# EAGLE design MCU_Module V3 (EAGLE 7.6.0)
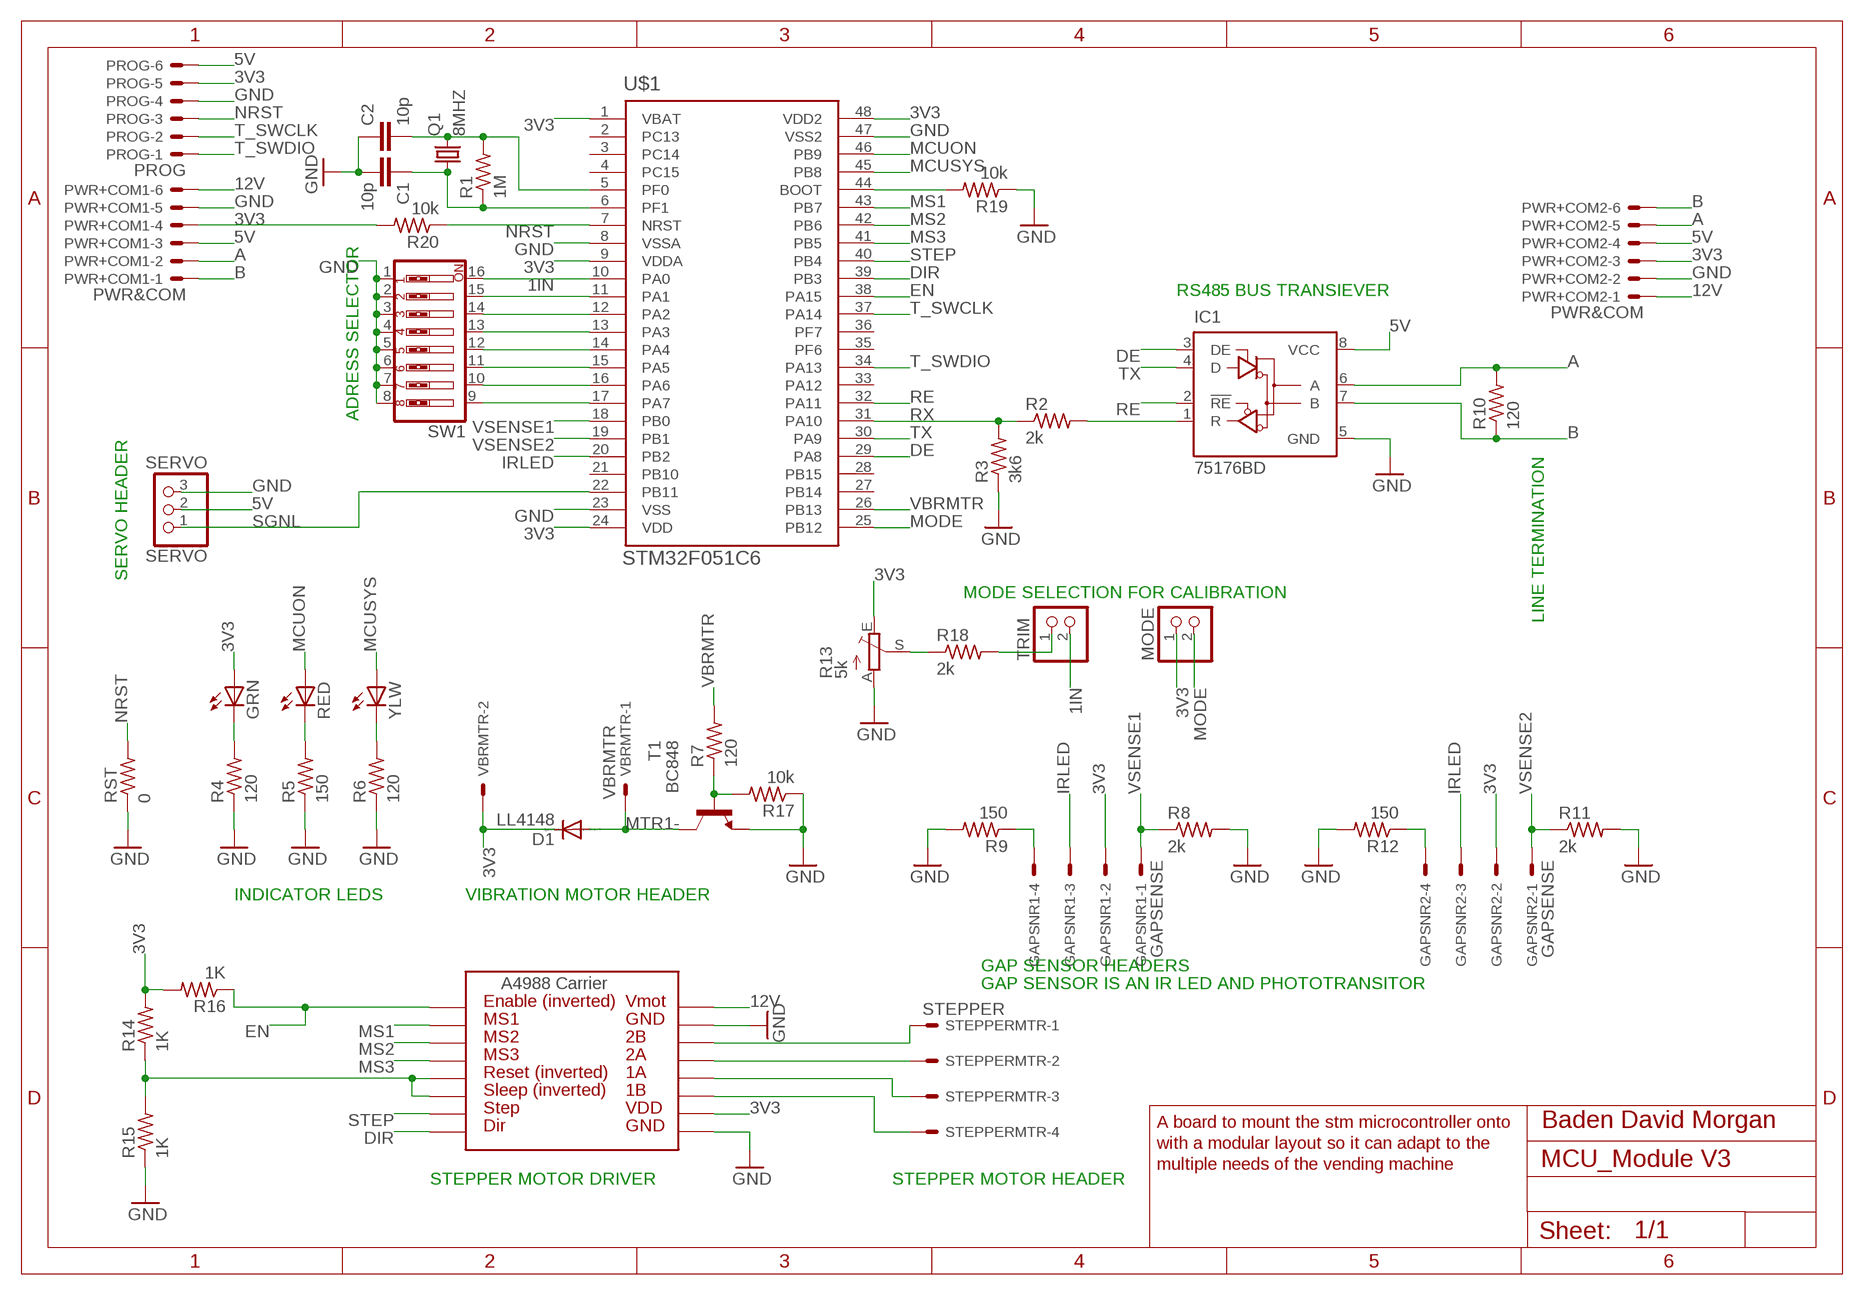
[diagram p0: schematic, sheet 1]

## Parts
C1  10p  C-EUC0805  [C0805]
C2  10p  C-EUC0805  [C0805]
D1  LL4148  PMLL4150  [SOD80C]
GAPSNR1  GAPSENSE  22-27-2041-04  [6410-04]
GAPSNR2  GAPSENSE  22-27-2041-04  [6410-04]
GRN  LEDSML1206  [SML1206]
IC1  75176BD  75176AD  [D_R-PDSO-G8]
MODE  PINHD-1X2  [1X02]
PROG  PROG  22-27-2061-06  [6410-06]
PWR+COM1  PWR&COM  22-05-7068-06  [7395-06]
PWR+COM2  PWR&COM  22-05-7068-06  [7395-06]
Q1  8MHZ  CRYSTALSM49  [SM49]
R1  1M  R-US_R0805  [R0805]
R2  2k  R-US_R0805  [R0805]
R3  3k6  R-US_R0805  [R0805]
R4  120  R-US_R0805  [R0805]
R5  150  R-US_R0805  [R0805]
R6  120  R-US_R0805  [R0805]
R7  120  R-US_R0805  [R0805]
R8  2k  R-US_R0805  [R0805]
R9  150  R-US_R0805  [R0805]
R10  120  R-US_R0805  [R0805]
R11  2k  R-US_R0805  [R0805]
R12  150  R-US_R0805  [R0805]
R13  5k  TRIM_EU-B25P  [B25P]
R14  1K  R-US_R0805  [R0805]
R15  1K  R-US_R0805  [R0805]
R16  1K  R-US_R0805  [R0805]
R17  10k  R-US_R0805  [R0805]
R18  2k  R-US_R0805  [R0805]
R19  10k  R-US_R0805  [R0805]
R20  10k  R-US_R0805  [R0805]
RED  LEDSML1206  [SML1206]
RST  0  R-US_R0805  [R0805]
SERVO  SERVO  PINHD-1X3  [1X03]
STEPPERMTR  STEPPER  22-27-2041-04  [6410-04]
SW1  SW_DIP-8  [EDG-08]
T1  BC848  [SOT23]
TRIM  PINHD-1X2  [1X02]
U$1  STM32F051C6  [QFP50P900X900X160-48N]
U$2  A4983CARRIER  [A4988BREAKOUT]
VBRMTR  VBRMTR  22-27-2021-02  [6410-02]
YLW  LEDSML1206  [SML1206]

## Nets
1IN: SW1.16 TRIM.2 U$1.10(PA0)
3V3: D1.C GAPSNR1.2 GAPSNR2.2 GRN.A MODE.1 PROG.5 PWR+COM1.4 PWR+COM2.3 R13.E R14.2 R16.2 R20.2 U$1.1(VBAT) U$1.9(VDDA) U$1.24(VDD) U$1.48(VDD2) U$2.VDD VBRMTR.2
5V: IC1.8(VCC) PROG.6 PWR+COM1.3 PWR+COM2.4 SERVO.2
8IN: SW1.9 U$1.17(PA7)
12V: PWR+COM1.6 PWR+COM2.1 U$2.VMOT
A: IC1.6(A) PWR+COM1.2 PWR+COM2.5 R10.2
B: IC1.7(B) PWR+COM1.1 PWR+COM2.6 R10.1
DE: IC1.3(DE) U$1.29(PA8)
DIR: U$1.39(PB3) U$2.DIR
EN: R16.1 U$1.38(PA15) U$2.EN
GND: C1.2 C2.1 IC1.5(GND) PROG.4 PWR+COM1.5 PWR+COM2.2 R3.1 R4.1 R5.1 R6.1 R8.2 R9.2 R11.2 R12.2 R13.A R15.1 R17.1 R19.1 RST.1 SERVO.3 SW1.1 SW1.2 SW1.3 SW1.4 SW1.5 SW1.6 SW1.7 SW1.8 T1.2(E) U$1.8(VSSA) U$1.23(VSS) U$1.47(VSS2) U$2.GND U$2.GND@0(GND)
IRLED: GAPSNR1.3 GAPSNR2.3 U$1.20(PB2)
MCUON: RED.A U$1.46(PB9)
MCUSYS: U$1.45(PB8) YLW.A
MODE: MODE.2 U$1.25(PB12)
MS1: U$1.43(PB7) U$2.MS1
MS2: U$1.42(PB6) U$2.MS2
MS3: U$1.41(PB5) U$2.MS3
MTR1-: D1.A T1.3(C) VBRMTR.1
N$1: C1.1 Q1.1 R1.1 U$1.6(PF1)
N$2: C2.2 Q1.2 R1.2 U$1.5(PF0)
N$5: STEPPERMTR.4 U$2.1B
N$6: SW1.15 U$1.11(PA1)
N$7: SW1.14 U$1.12(PA2)
N$8: SW1.13 U$1.13(PA3)
N$9: IC1.1(R) R2.2
N$10: SW1.12 U$1.14(PA4)
N$11: SW1.11 U$1.15(PA5)
N$12: SW1.10 U$1.16(PA6)
N$13: R13.S R18.1
N$14: GRN.C R4.2
N$15: R5.2 RED.C
N$16: R6.2 YLW.C
N$17: R7.1 R17.2 T1.1(B)
N$18: STEPPERMTR.3 U$2.1A
N$19: GAPSNR1.4 R9.1
N$20: STEPPERMTR.2 U$2.2A
N$21: STEPPERMTR.1 U$2.2B
N$22: R19.2 U$1.44(BOOT)
N$23: R18.2 TRIM.1
N$24: GAPSNR2.4 R12.1
N$26: R14.1 R15.2 U$2.RST U$2.SLP(SLEEP)
NRST: PROG.3 R20.1 RST.2 U$1.7(NRST)
RE: IC1.2(!RE) U$1.32(PA11)
RX: R2.1 R3.2 U$1.31(PA10)
SGNL: SERVO.1 U$1.22(PB11)
STEP: U$1.40(PB4) U$2.STEP
T_SWCLK: PROG.2 U$1.37(PA14)
T_SWDIO: PROG.1 U$1.34(PA13)
TX: IC1.4(D) U$1.30(PA9)
VBRMTR: R7.2 U$1.26(PB13)
VSENSE1: GAPSNR1.1 R8.1 U$1.18(PB0)
VSENSE2: GAPSNR2.1 R11.1 U$1.19(PB1)
Unconnected: U$1.2(PC13) U$1.3(PC14) U$1.4(PC15) U$1.21(PB10) U$1.27(PB14) U$1.28(PB15) U$1.33(PA12) U$1.35(PF6) U$1.36(PF7)

## Notes on the sheet
- RS485 BUS TRANSIEVER
- ADRESS SELECTOR
- LINE TERMINATION
- SERVO HEADER
- MODE SELECTION FOR CALIBRATION
- INDICATOR LEDS | VIBRATION MOTOR HEADER
- GAP SENSOR HEADERS
- GAP SENSOR IS AN IR LED AND PHOTOTRANSITOR
- A board to mount the stm microcontroller onto | Baden David Morgan
- with a modular layout so it can adapt to the
- multiple needs of the vending machine
- STEPPER MOTOR DRIVER | STEPPER MOTOR HEADER

## Library data of the parts
C1 C2 = rcl:C-EU: CAPACITOR, European symbol
D1 = diode:PMLL4150: DIODE high speed
GAPSNR1 GAPSNR2 STEPPERMTR = con-molex:22-?-04: CONNECTOR wire to board 2.54 mm (.1 inch) pitch header; OC_FARNELL: unknown; OC_NEWARK: unknown
GRN RED YLW = led:LED: LED OSRAM: - CHIPLED LG R971, LG N971, LY N971, LG Q971, LY Q971, LO R971, LY R971 LH N974, LH R974 LS Q976, LO Q976, LY Q976 LO Q996 - Hyper CHIPLED LW Q18S LB Q993, LB Q99A, LB R99A - SideLED LS A670, LO A670, LY A670, LG A670, LP A670 LB A673, LV A673, LT A673, LW A673 LH A674 LY A675 LS A676, LA A676, LO A676, LY A676, LW A676 LS A679, LY A679, LG A679 - Hyper Micro SIDELED® LS Y876, LA Y876, LO Y876, LY Y876 LT Y87S - SmartLED LW L88C, LW L88S LB L89C, LB L89S, LG L890 LS L89K, LO L89K, LY L89K LS L896, LA L896, LO L896, LY L896 - TOPLED LS T670, LO T670, LY T670, LG T670, LP T670 LSG T670, LSP T670, LSY T670, LOP T670, LYG T670 LG T671, LOG T671, LSG T671 LB T673, LV T673, LT T673, LW T673 LH T674 LS T676, LA T676, LO T676, LY T676, LB T676, LH T676, LSB T676, LW T676 LB T67C, LV T67C, LT T67C, LS T67K, LO T67K, LY T67K, LW E67C LS E67B, LA E67B, LO E67B, LY E67B, LB E67C, LV E67C, LT E67C LW T67C LS T679, LY T679, LG T679 LS T770, LO T770, LY T770, LG T770, LP T770 LB T773, LV T773, LT T773, LW T773 LH T774 LS E675, LA E675, LY E675, LS T675 LS T776, LA T776, LO T776, LY T776, LB T776 LHGB T686 LT T68C, LB T68C - Hyper Mini TOPLED® LB M676 - Mini TOPLED Santana® LG M470 LS M47K, LO M47K, LY M47K Source: http://www.osram.convergy.de LUXEON: - LUMILED® LXK2-PW12-R00, LXK2-PW12-S00, LXK2-PW14-U00, LXK2-PW14-V00 LXK2-PM12-R00, LXK2-PM12-S00, LXK2-PM14-U00 LXK2-PE12-Q00, LXK2-PE12-R00, LXK2-PE12-S00, LXK2-PE14-T00, LXK2-PE14-U00 LXK2-PB12-K00, LXK2-PB12-L00, LXK2-PB12-M00, LXK2-PB14-N00, LXK2-PB14-P00, LXK2-PB14-Q00 LXK2-PR12-L00, LXK2-PR12-M00, LXK2-PR14-Q00, LXK2-PR14-R00 LXK2-PD12-Q00, LXK2-PD12-R00, LXK2-PD12-S00 LXK2-PH12-R00, LXK2-PH12-S00 LXK2-PL12-P00, LXK2-PL12-Q00, LXK2-PL12-R00 Source: www.luxeon.com KINGBRIGHT: KA-3528ASYC Source: www.kingbright.com
IC1 = 751xx:75176A: DIFFERENTIAL BUS TRANSCEIVER Source: http://focus.ti.com/lit/ds/symlink/sn75176a.pdf
MODE TRIM = pinhead:PINHD-1X2: PIN HEADER
PROG PWR+COM1 PWR+COM2 = con-molex:22-?-06: CONNECTOR wire to board 2.54 mm (.1 inch) pitch header; OC_FARNELL: unknown; OC_NEWARK: unknown
Q1 = crystal:CRYSTAL: CRYSTAL; OC_FARNELL: unknown; OC_NEWARK: unknown
R1 R4-R7 R9 R12 R14-R17 R19 R20 RST = rcl:R-US_: RESISTOR, American symbol
R2 R3 R8 R10 R11 R18 = resistor:R-US_: RESISTOR, American symbol
R13 = pot:TRIM_EU-: POTENTIOMETER
SERVO = pinhead:PINHD-1X3: PIN HEADER
SW1 = special:SW_DIP-8: DIP SWITCH
T1 = transistor:BC848: NPN TRANSISTOR
U$1 = STM32F0:STM32F051C6
U$2 = RepRapjr:A4983CARRIER
VBRMTR = con-molex:22-?-02: CONNECTOR wire to board 2.54 mm (.1 inch) pitch header; OC_FARNELL: unknown; OC_NEWARK: unknown

## Board
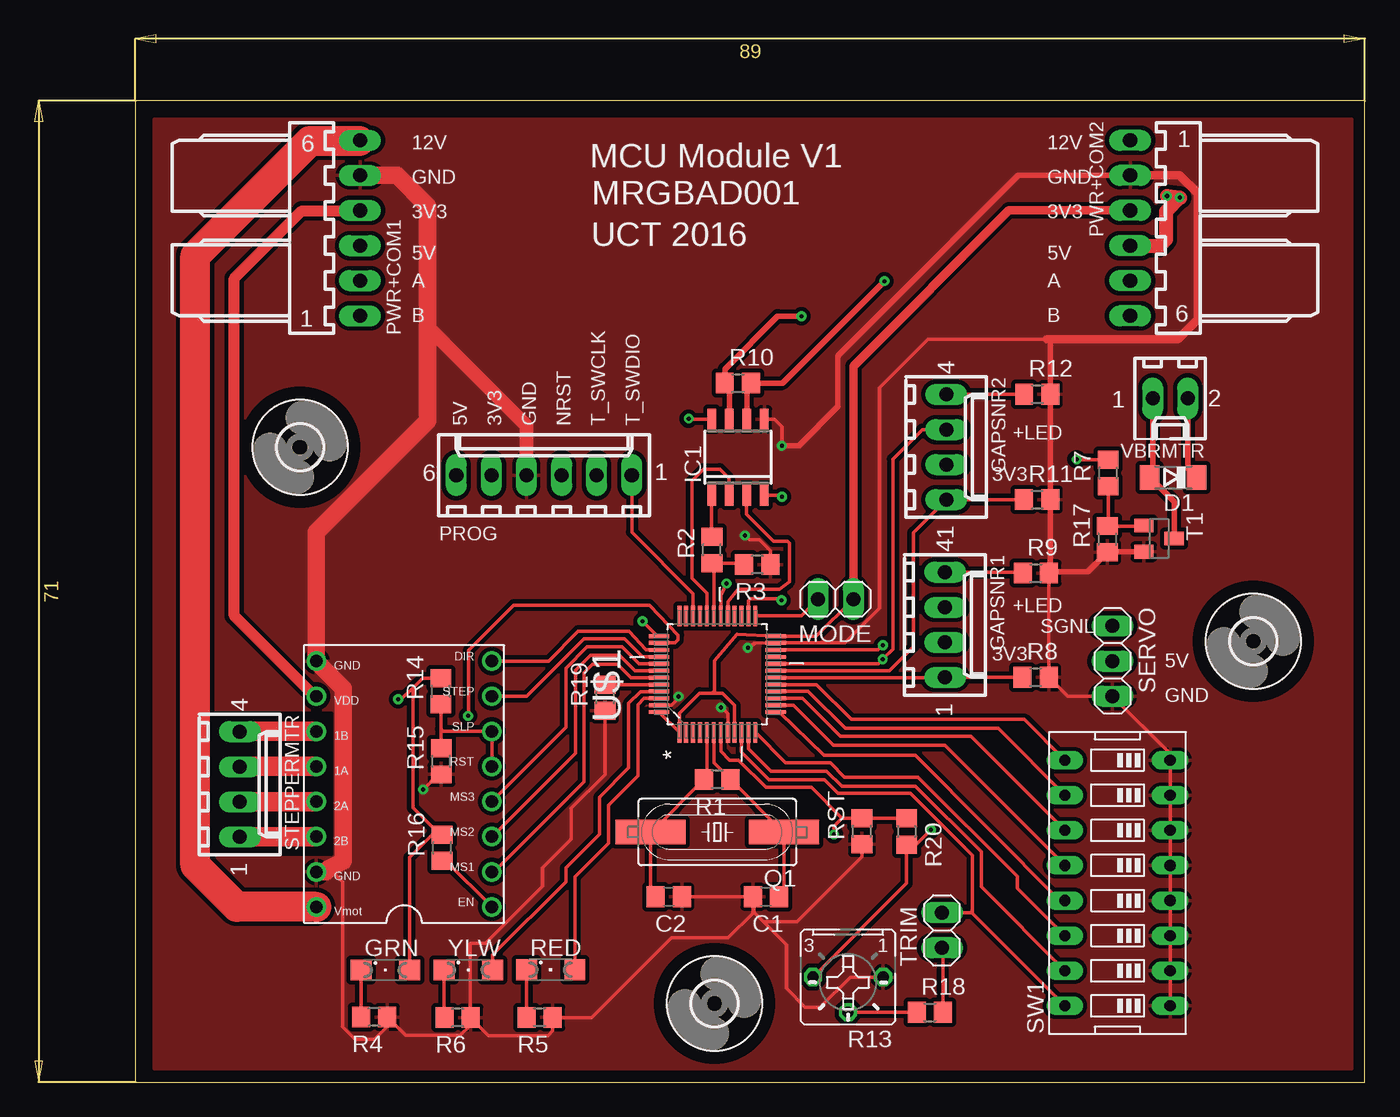
[diagram p1: board, top side]
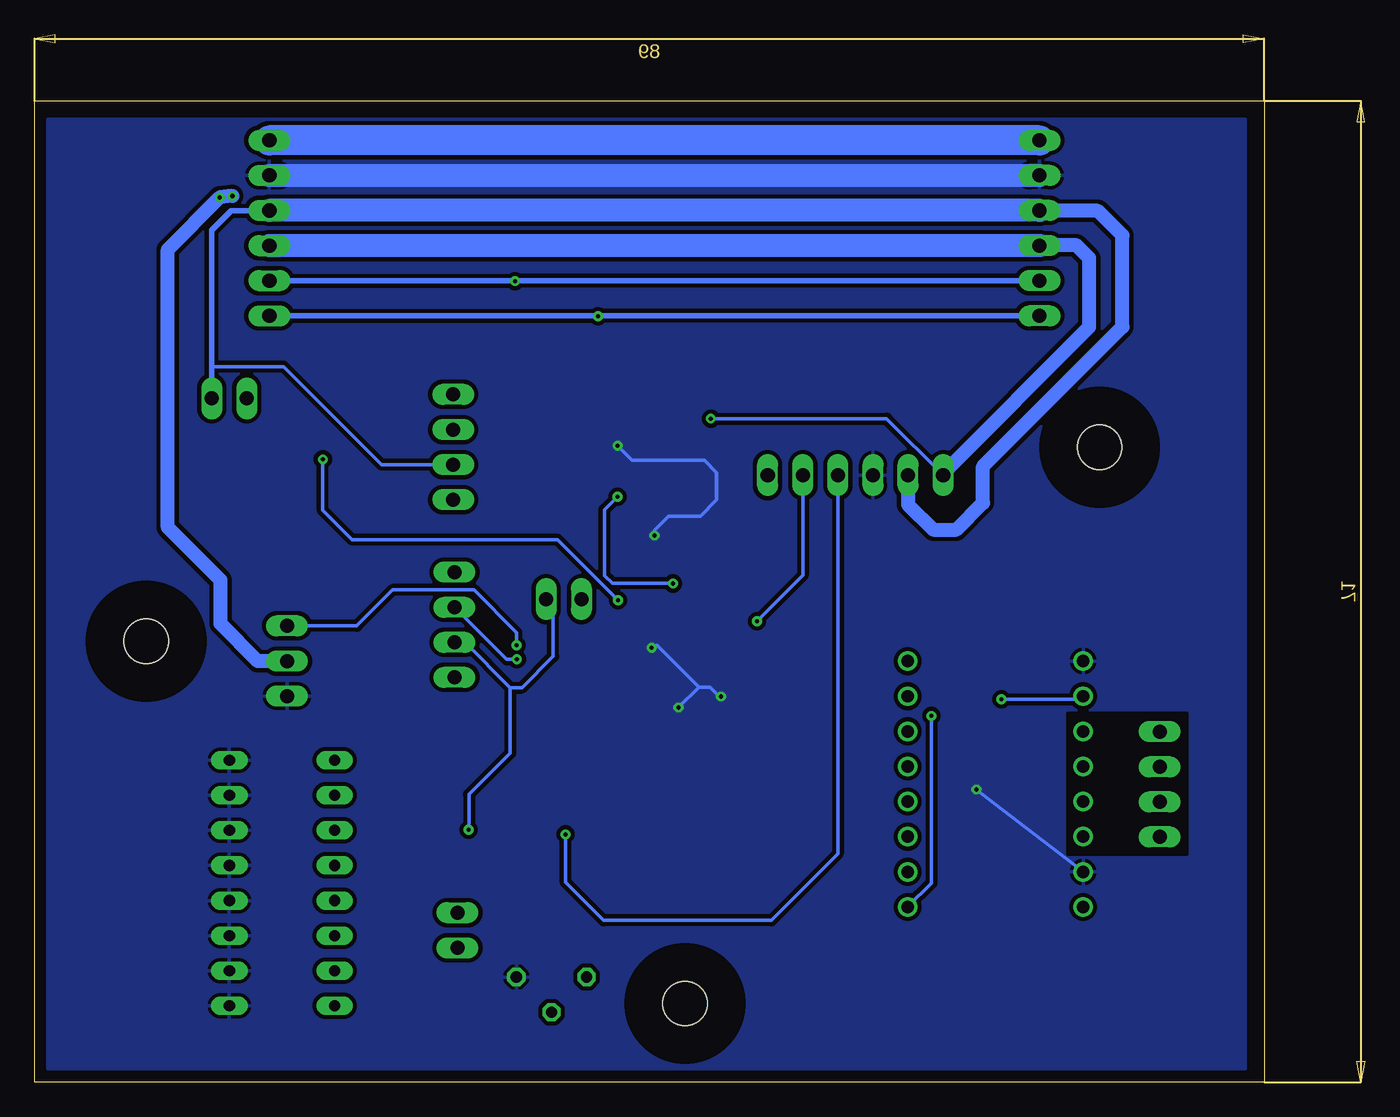
[diagram p2: board, bottom side, seen from below]

Size 89 x 71 mm. Coordinates in mm from the lower left corner, seen from the top.
Outline: 0,0 89,0 89,71 0,71 0,0
Copper layers (1*16): Top 0.035mm / dielectric 1.5mm / Bottom 0.035mm
Design rules "trax_discount_template": minimum track width 10mil, minimum drill 0.25mil, track to track 0.25mm, track to pad 0.25mm, pad to pad 0.25mm, via to via 0.25mm, smd to smd 0.25mm, copper to edge 0.25mm, drill to drill 0.3mm, minimum pad ring 10mil, minimum via ring 8mil, stop-mask expansion 4mil, vias tented up to drill 0mil, thermal gap 10mil

### Footprints (pad centres in the part's own frame; a part is rotated, then mirrored left to right if it is on the bottom)
C0805 = smd 1.3 x 1.5: 1 -0.95,0; 2 0.95,0
SOD80C = smd 1.4 x 1.8: A 1.7,0; C -1.7,0
6410-04 = drill 1.016 long: 1 3.81,0; 2 1.27,0; 3 -1.27,0; 4 -3.81,0
SML1206 = smd 1.5 x 1.5: A 1.75,0; C -1.75,0
D_R-PDSO-G8 = smd 0.6 x 1.5: 1 -1.905,-2.75; 2 -0.635,-2.75; 3 0.635,-2.75; 4 1.905,-2.75; 5 1.905,2.75; 6 0.635,2.75; 7 -0.635,2.75; 8 -1.905,2.75
1X02 = drill 1.016 long: 1 -1.27,0; 2 1.27,0
6410-06 = drill 1.016 long: 1 6.35,0; 2 3.81,0; 3 1.27,0; 4 -1.27,0; 5 -3.81,0; 6 -6.35,0
7395-06 = drill 1.016 long: 1 6.35,0; 2 3.81,0; 3 1.27,0; 4 -1.27,0; 5 -3.81,0; 6 -6.35,0
SM49 = smd 5.08 x 1.778: 1 -4.826,0; 2 4.826,0
R0805 = smd 1.3 x 1.5: 1 -0.95,0; 2 0.95,0
B25P = drill 0.813 octagon: A -2.54,0; E 2.54,0; S 0,2.54
1X03 = drill 1.016 long: 1 -2.54,0; 2 0,0; 3 2.54,0
EDG-08 = drill 0.813 long: 1 -8.89,-3.81; 2 -6.35,-3.81; 3 -3.81,-3.81; 4 -1.27,-3.81; 5 1.27,-3.81; 6 3.81,-3.81; 7 6.35,-3.81; 8 8.89,-3.81; 9 8.89,3.81; 10 6.35,3.81; 11 3.81,3.81; 12 1.27,3.81; 13 -1.27,3.81; 14 -3.81,3.81; 15 -6.35,3.81; 16 -8.89,3.81
SOT23 = smd 1 x 1.4: 1 -0.95,-1.1; 2 0.95,-1.1; 3 0,1.1
QFP50P900X900X160-48N = smd 1.473 x 0.279: 1 -4.216,2.743; 2 -4.216,2.261; 3 -4.216,1.753; 4 -4.216,1.245; 5 -4.216,0.762; 6 -4.216,0.254; 7 -4.216,-0.254; 8 -4.216,-0.762; 9 -4.216,-1.245; 10 -4.216,-1.753; 11 -4.216,-2.261; 12 -4.216,-2.743; 25 4.216,-2.743; 26 4.216,-2.261; 27 4.216,-1.753; 28 4.216,-1.245; 29 4.216,-0.762; 30 4.216,-0.254; 31 4.216,0.254; 32 4.216,0.762; 33 4.216,1.245; 34 4.216,1.753; 35 4.216,2.261; 36 4.216,2.743 | smd 0.279 x 1.473: 13 -2.743,-4.216; 14 -2.261,-4.216; 15 -1.753,-4.216; 16 -1.245,-4.216; 17 -0.762,-4.216; 18 -0.254,-4.216; 19 0.254,-4.216; 20 0.762,-4.216; 21 1.245,-4.216; 22 1.753,-4.216; 23 2.261,-4.216; 24 2.743,-4.216; 37 2.743,4.216; 38 2.261,4.216; 39 1.753,4.216; 40 1.245,4.216; 41 0.762,4.216; 42 0.254,4.216; 43 -0.254,4.216; 44 -0.762,4.216; 45 -1.245,4.216; 46 -1.753,4.216; 47 -2.261,4.216; 48 -2.743,4.216
A4988BREAKOUT = drill 0.9: 1A 8.89,1.27; 1B 11.43,1.27; 2A 6.35,1.27; 2B 3.81,1.27; DIR 16.51,-11.43; EN -1.27,-11.43; GND 16.51,1.27; GND@0 1.27,1.27; MS1 1.27,-11.43; MS2 3.81,-11.43; MS3 6.35,-11.43; RST 8.89,-11.43; SLP 11.43,-11.43; STEP 13.97,-11.43; VDD 13.97,1.27; VMOT -1.27,1.27
3,2 = hole 3.2: 0,0
6410-02 = drill 1.016 long: 1 1.27,0; 2 -1.27,0

### Placement (x,y rotation side)
C1  45.64,13.41 180 top
C2  38.6,13.41 180 top
D1  75.12,43.75 180 top
GAPSNR1  58.6,33.09 270 top
GAPSNR2  58.69,45.95 270 top
GRN  18.09,8.11 0 top
IC1  43.62,45.22 0 top
MODE  50.69,34.95 180 top
PROG  29.58,43.92 0 top
PWR+COM1  16.26,61.8 270 top
PWR+COM2  72,61.8 90 top
Q1  42.12,18.09 180 top
R1  42.12,21.9 180 top
R2  41.73,38.51 90 top
R3  45.01,37.45 180 top
R4  17.28,4.71 180 top
R5  29.25,4.68 180 top
R6  23.32,4.67 180 top
R7  70.41,44.08 90 top
R8  65.16,29.3 0 top
R9  65.18,36.83 0 top
R10  43.61,50.58 0 top
R11  65.27,42.15 0 top
R12  65.28,49.78 0 top
R13  51.58,7.6 180 top
R14  22.11,28.29 90 top
R15  22.14,23.21 90 top
R16  22.2,16.96 90 top
R17  70.36,39.29 90 top
R18  57.51,5.05 0 top
R19  34,27.81 90 top
R20  55.82,18.14 270 top
RED  30.06,8.13 0 top
RST  52.59,18.16 90 top
SERVO  70.73,30.47 270 top
STEPPERMTR  7.55,21.55 270 top
SW1  71.09,14.41 90 top
T1  74.09,39.33 270 top
TRIM  58.39,10.99 90 top
U$1  42.12,29.52 90 top
U$2  14.37,13.95 90 top
U$3  [3,2]  80.92,31.9 0 top
U$4  [3,2]  41.92,5.69 0 top
U$5  [3,2]  11.92,45.94 0 top
VBRMTR  74.9,49.47 180 top
YLW  24.1,8.12 0 top

### Tracks (layer width: path | path; a pad name or v marks a point on that pad's centre or on a via)
1IN
  Top 0.254: U$1.10 43.87,23.89 45.87,21.89 49.89,21.89 50.87,20.91 56.11,20.91 60.59,16.43 60.59,12.42 | 60.59,12.42 60.59,12.21 SW1.16 | TRIM.2 60.43,12.26 60.59,12.42
3V3  (via drill 0.3)
  Top 0.254: U$1.48 U$1.1 39.38,26.71 40.82,28.15 41.75,28.15 | 41.75,28.15 42.49,28.15 43.37,27.27 U$1.9 | 41.75,28.15 41.93,28.33 41.93,30.49 43.55,32.39 U$1.24 49.27,32.26 MODE.1 | R13.E 55.82,14.38 R20.2 56.5,17.19 v57.58,18.27 | R16.2 22.03,17.91 21.76,18.18 | 21.76,18.18 20.09,19.85 20.09,28.54 | 20.09,28.54 20.79,29.24 R14.2 | GRN.A 19.84,16.26 21.76,18.18 | v19.02,27.7 19.25,27.7 20.09,28.54
  Top 0.406: VBRMTR.2 76.17,44.4 D1.C | U$2.VDD 12.97,27.92 | 16.24,63.05 PWR+COM1.4
  Top 0.61: MODE.1 51.96,51.79 63.24,63.07 PWR+COM2.3
  Top 0.813: 12.97,27.92 7.16,33.73 7.16,58.16 12.05,63.05 16.24,63.05
  Bottom 0.254: v19.02,27.7 13.32,27.7 U$2.VDD | PWR+COM2.3 | GAPSNR1.2 57.84,31.82 54.57,28.55 | 54.57,28.55 53.72,28.55 51.46,30.81 51.46,34.45 MODE.1 | GAPSNR2.2 63.88,44.68 70.97,51.77 76.14,51.77 76.17,51.74 | 54.57,28.55 54.57,23.8 57.55,20.82 57.55,18.3 v57.58,18.27
  Bottom 0.406: VBRMTR.2 76.17,51.74 76.17,61.64 74.75,63.06 PWR+COM2.3
  Bottom 1.016: PROG.5 25.77,41.79 23.95,39.97 22.29,39.97 20.34,41.92 20.34,44.56 10.26,54.64 10.26,61.26 12.05,63.05 16.24,63.05 PWR+COM1.4
  Bottom 1.676: PWR+COM1.4 PWR+COM2.3
5V  (via drill 0.3)
  Top 0.254: IC1.8 40.09,47.97 v40.05,48.01
  Top 1.016: v74.68,64.12 v75.58,64.02 75.62,63.98 75.58,63.98 74.59,62.99 74.59,60.97 74.12,60.5 72.03,60.5 PWR+COM2.4
  Bottom 0.254: v40.05,48.01 27.32,48.01 PROG.6
  Bottom 1.016: PROG.6 23.23,44.07 12.66,54.64 12.66,59.63 13.58,60.55 16.24,60.55 PWR+COM1.3 | SERVO.2 72.84,30.47 75.54,33.17 75.54,36.32 79.36,40.14 79.36,60.24 v75.59,64.01 v75.58,64.02 v74.68,64.12
  Bottom 1.676: PWR+COM1.3 PWR+COM2.4
8IN
  Top 0.254: U$1.17 49.31,28.76 51.82,26.25 64.33,26.25 SW1.9
12V
  Top 1.27: 16.21,68.1 PWR+COM1.6
  Top 2.184: U$2.VMOT 7.34,12.68 4.34,15.68 4.34,59.8 12.64,68.1 16.21,68.1
  Bottom 2.184: PWR+COM1.6 PWR+COM2.1
A  (via drill 0.3)
  Top 0.406: v54.21,57.96 46.83,50.58 R10.2 44.26,50.27 IC1.6
  Bottom 0.406: PWR+COM2.5 54.24,57.99 v54.21,57.96 54.18,57.99 PWR+COM1.2
B  (via drill 0.3)
  Top 0.406: v48.21,55.42 46.49,55.42 42.66,51.59 R10.1 42.98,50.26 IC1.7
  Bottom 0.406: PWR+COM2.6 48.24,55.45 v48.21,55.42 48.18,55.45 PWR+COM1.1
DE
  Top 0.254: U$1.29 42.88,34.75 43.6,35.68 46.63,35.68 47.33,36.22 47.34,39 47.19,39.15 46.18,39.15 44.25,41.08 IC1.3
DIR
  Top 0.254: U$1.39 36.97,31.27 35.72,32.64 32.05,32.64 29.91,30.46 U$2.DIR
EN  (via drill 0.3)
  Top 0.254: U$1.38 39.05,31.78 39.27,32 39.28,32.34 37.21,34.51 27.39,34.51 24.12,31.24 24.12,26.54 v24.08,26.5 | R16.1 22.47,16.01 U$2.EN
  Bottom 0.254: v24.08,26.5 24.08,14.4 U$2.EN
GND  (via drill 0.3)
  Top 0.254: v42.38,27.11 42.43,27.11 42.89,26.65 42.89,25.31 U$1.8 | v44.33,31.44 44.86,31.76 U$1.23 51.37,31.78 53.87,34.28 53.87,50.25 57.38,53.76 65.97,53.76 66.22,53.51 | v39.32,27.9 39.32,27.79 38.79,27.26 U$1.47 | R3.1 45.96,38.44 45.16,39.24 44.44,39.24 v44.13,39.55 | IC1.5 46.25,47.97 46.79,47.43 v46.79,46.04 | C2.1 C1.2 | RST.1 52.59,16.31 47.87,11.59 45.47,11.59 | 45.47,11.59 44.76,12.3 44.76,13.34 C1.2 | R6.1 25.57,3.37 29.87,3.37 30.2,3.7 R5.1 30.22,4.66 33.02,4.66 38.79,10.43 42.9,10.43 44.69,12.22 C1.2 | R6.1 24.27,4.13 23.52,3.38 19.56,3.38 18.58,4.36 | 18.58,4.36 R4.1 | SW1.1 SW1.2 SW1.3 SW1.4 SW1.5 SW1.6 SW1.7 SW1.8 74.9,23.76 SERVO.3 67.48,27.93 R8.2 66.11,36.81 R9.2 66.22,36.92 | R12.2 | 70.4,38.38 R17.1 | R13.A 51.74,7.6 49.56,5.42 48.47,5.42 47.11,6.78 47.11,9.95 45.47,11.59 | 18.58,4.36 17.32,3.1 15.9,3.1 15,4 15,14.5 14.04,15.46 | PWR+COM2.2 | R15.1 21.92,22.26 v20.83,21.17 | R19.1 34,22.25 31.55,19.8 31.55,17.58 29.48,15.51 29.48,14.19 25.35,10.06 24.27,10.06 24.22,10.01 24.22,4.72 R6.1
  Top 0.406: T1.2 70.4,38.38 | R17.1 68.94,36.92 66.22,36.92 R11.2 R12.2 66.22,53.51 | v46.79,46.04 48.02,46.04 50.87,48.89 50.87,52.57 63.91,65.61 PWR+COM2.2
  Top 0.61: 65.97,53.76 75.47,53.76 76.9,55.19 76.9,64.3 75.58,65.62 PWR+COM2.2
  Top 1.016: PROG.4 28.31,47.48 21.15,54.64
  Top 1.27: U$2.GND@0 13.8,15.22 14.04,15.46 15.05,15.97 15.05,28.51 U$2.GND 13.1,39.8 21.15,47.85 21.15,54.64 21.15,63.39 18.93,65.61 PWR+COM1.5
  Bottom 0.254: v39.32,27.9 39.42,27.9 40.1,28.58 40.91,28.58 | 40.91,28.58 v42.38,27.11 | v44.33,31.44 43.93,31.6 40.91,28.58 | v44.13,39.55 44.13,39.94 43.11,40.96 40.81,40.96 39.63,42.14 39.63,44.11 40.51,44.99 45.74,44.99 v46.79,46.04 | v20.83,21.17 19.55,20.17 U$2.GND@0
  Bottom 1.676: PWR+COM2.2 PWR+COM1.5
  pour Bottom (isolate 0.3): 1.35,69.67 88.03,69.67 88.03,0.96 1.35,0.96
  pour Top (isolate 0.3): 1.36,69.67 88.03,69.67 88.03,0.96 1.35,0.96
IRLED  (via drill 0.3)
  Top 0.254: U$1.20 53.78,30.28 v54.09,30.59 54.82,31.32 54.82,45.08 56.96,47.22 GAPSNR2.3
  Bottom 0.254: v54.09,30.59 54.83,30.59 GAPSNR1.3
MCUON
  Top 0.254: RED.A 31.81,14.86 34.25,17.3 34.25,20.03 36.39,22.17 36.39,27.32 36.83,27.76 U$1.46
MCUSYS
  Top 0.254: YLW.A 25.85,9.2 31.16,14.51 31.16,15.51 33.58,17.93 33.58,20.61 35.71,22.74 35.71,27.41 36.56,28.26 37.89,28.26 U$1.45
MODE
  Top 0.254: U$1.25 48.21,33.74 MODE.2
MS1
  Top 0.254: U$2.MS1 25.95,15.22 32.47,21.74 32.47,29.62 33.08,30.23 34.9,30.23 35.86,29.27 U$1.43
MS2
  Top 0.254: U$2.MS2 31.85,23.81 31.85,29.8 32.94,30.89 35.05,30.89 36.17,29.77 U$1.42
MS3
  Top 0.254: U$2.MS3 25.8,20.32 31.17,25.69 31.17,29.96 32.7,31.49 35.24,31.49 36.45,30.28 U$1.41
MTR1-
  Top 0.254: 73.63,43.96 D1.A
  Top 0.406: VBRMTR.1 73.63,43.96 | T1.3 75.19,41.98 D1.A
N$1
  Top 0.254: U$1.6 41.87,23.1 R1.1 46.88,18.09 Q1.1 46.95,13.77 C1.1
N$2
  Top 0.254: U$1.5 41.36,22.09 R1.2 37.36,18.09 Q1.2 37.29,13.77 C2.2
N$3
  cutout Top (isolate 0.15): 5.6,26.7 14.2,26.7 14.2,16.5 5.6,16.5
N$5
  Top 1.422: U$2.1B 7.57,25.38 STEPPERMTR.4
N$6
  Top 0.254: SW1.15 61.22,14.12 61.22,16.67 56.47,21.42 51.14,21.42 50.01,22.5 45.99,22.5 44.38,24.11 U$1.11
N$7
  Top 0.254: U$1.12 47.07,23.1 50.3,23.1 51.33,22.07 56.66,22.07 63.85,14.88 63.85,14.03 SW1.14
N$8
  Top 0.254: SW1.13 66.91,13.14 56.47,23.64 49.83,23.64 46.63,26.78 U$1.13
N$9
  Top 0.254: IC1.1 41.72,39.48 R2.2
N$10
  Top 0.254: U$1.14 47.62,27.26 50.51,24.37 58.59,24.37 SW1.12
N$11
  Top 0.254: U$1.15 48.27,27.77 51.02,25.02 60.48,25.02 SW1.11
N$12
  Top 0.254: U$1.16 48.7,28.27 51.38,25.59 62.45,25.59 SW1.10
N$13
  Top 0.254: R18.1 R13.S
N$14
  Top 0.254: R4.2 GRN.C
N$15
  Top 0.254: RED.C R5.2
N$16
  Top 0.254: YLW.C 22.35,4.69 R6.2
N$17
  Top 0.254: T1.1 72.95,40.24 R17.2 70.41,40.29 R7.1
N$18
  Top 1.422: U$2.1A 7.57,22.84 STEPPERMTR.3
N$19
  Top 0.254: GAPSNR1.4 64.16,36.9 R9.1
N$20
  Top 1.422: U$2.2A 7.57,20.3 STEPPERMTR.2
N$21
  Top 1.422: U$2.2B 7.57,17.76 STEPPERMTR.1
N$22
  Top 0.254: U$1.44 R19.2
N$23
  Top 0.254: R18.2 58.46,9.65 TRIM.1
N$24
  Top 0.254: R12.1 58.71,49.78 GAPSNR2.4
N$26
  Top 0.254: U$2.RST U$2.SLP 22.27,25.38 22.11,25.54 | R14.1 22.11,25.54 | 22.11,25.54 22.11,24.19 R15.2
N$28
  cutout Bottom (isolate 0.15): 5.6,26.7 14.2,26.7 14.2,16.5 5.6,16.5
NRST  (via drill 0.3)
  Top 0.254: R20.1 52.61,19.09 RST.2 51.14,19.11 | 51.14,19.11 48.93,21.32 45.64,21.32 43.67,23.29 43.03,23.29 43.02,23.28 42.37,23.93 U$1.7 | v50.56,17.92 50.56,18.53 51.14,19.11
  Bottom 0.254: PROG.3 30.85,16.53 35.67,11.71 47.81,11.71 50.55,14.45 v50.55,17.91 v50.56,17.92
RE
  Top 0.254: U$1.32 41.36,35.39 40.28,36.47 40.28,43.5 41.13,44.35 42.3,44.35 42.97,43.68 42.97,42.48 IC1.2
RX
  Top 0.254: R3.2 43.95,37.56 R2.1 41.87,37.42 U$1.31
SGNL  (via drill 0.3)
  Top 0.254: U$1.22 53.76,31.27 v54.11,31.62
  Bottom 0.254: v54.11,31.62 54.11,32.53 57.19,35.61 63.07,35.61 65.67,33.01 SERVO.1
STEP
  Top 0.254: U$1.40 36.72,30.77 35.41,32.07 32.47,32.07 28.32,27.92 U$2.STEP
T_SWCLK  (via drill 0.3)
  Top 0.254: U$1.37 37.79,32.26 v36.71,33.34
  Bottom 0.254: PROG.2 33.39,36.66 v36.71,33.34
T_SWDIO
  Top 0.254: PROG.1 35.93,39.79 40.37,35.35 U$1.34
TX  (via drill 0.3)
  Top 0.254: U$1.30 42.37,35.22 v42.79,36.08 | IC1.4 46.7,42.47 v46.81,42.36
  Bottom 0.254: v42.79,36.08 47.18,36.1 47.75,36.65 47.75,41.42 v46.81,42.36
VBRMTR  (via drill 0.3)
  Top 0.254: R7.2 68.16,45.03 v68.13,45.06 | U$1.26 44.38,34.83 44.54,34.99 46.64,34.99 v46.77,34.86
  Bottom 0.254: v46.77,34.86 v46.77,34.87 51.15,39.25 66.01,39.25 68.13,41.37 v68.13,45.06
VSENSE1
  Top 0.254: R8.1 64.19,29.28 GAPSNR1.1 58.59,29.27 U$1.18
VSENSE2
  Top 0.254: R11.1 GAPSNR2.1 56.31,39.76 56.31,31.49 54.59,29.77 U$1.19

### Text on the board
tNames: 12V | 12V | MCU Module V1 | GND | GND | MRGBAD001 | 3V3 | 3V3 | 5V | UCT 2016 | 5V | A | A | B | B | 5V | 3V3 | GND | NRST | T_SWCLK | T_SWDIO | +LED | 3V3 | +LED | SGNL | 3V3 | 5V | GND